# EAGLE design CTD_Prototype_v1.0 (EAGLE 8.4.1)
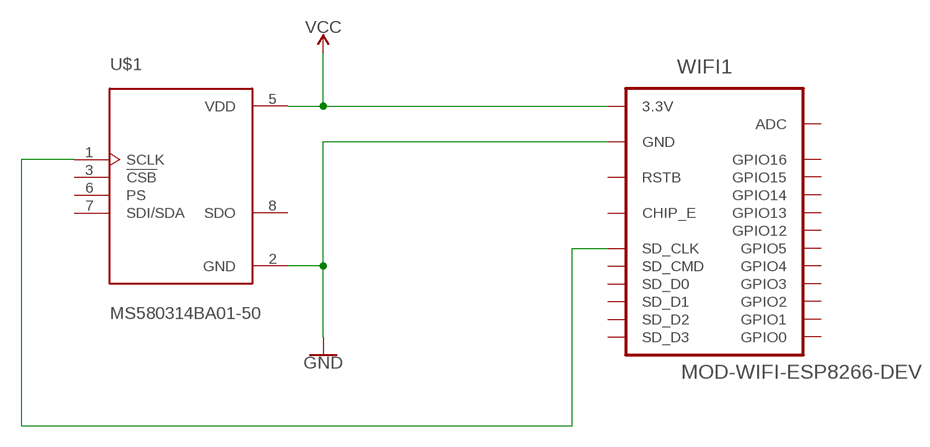
[diagram p0: schematic, sheet 1]

## Parts
U$1  MS580314BA01-50  [XDCR_MS580314BA01-50]
WIFI1  MOD-WIFI-ESP8266-DEV  [MOD-WIFI-ESP8266-DEV]

## Nets
GND: U$1.2(GND) WIFI1.GND WIFI1.GND.1(GND)
N$1: U$1.1(SCLK) WIFI1.SD_CLK WIFI1.SD_CLK.1(SD_CLK)
VCC: U$1.5(VDD) WIFI1.3.3V WIFI1.3.3V.1(3.3V)
Unconnected: U$1.3(!CSB) U$1.6(PS) U$1.7(SDI/SDA) U$1.8(SDO) WIFI1.ADC WIFI1.ADC.1(ADC) WIFI1.CHIP_E WIFI1.CHIP_E.1(CHIP_E) WIFI1.GPIO0 WIFI1.GPIO0.1(GPIO0) WIFI1.GPIO1 WIFI1.GPIO1.1(GPIO1) WIFI1.GPIO2 WIFI1.GPIO2.1(GPIO2) WIFI1.GPIO3 WIFI1.GPIO3.1(GPIO3) WIFI1.GPIO4 WIFI1.GPIO4.1(GPIO4) WIFI1.GPIO5 WIFI1.GPIO5.1(GPIO5) WIFI1.GPIO12 WIFI1.GPIO12.1(GPIO12) WIFI1.GPIO13 WIFI1.GPIO13.1(GPIO13) WIFI1.GPIO14 WIFI1.GPIO14.1(GPIO14) WIFI1.GPIO15 WIFI1.GPIO15.1(GPIO15) WIFI1.GPIO16 WIFI1.GPIO16.1(GPIO16) WIFI1.RSTB WIFI1.RSTB.1(RSTB) WIFI1.SD_CMD WIFI1.SD_CMD.1(SD_CMD) WIFI1.SD_D0 WIFI1.SD_D0.1(SD_D0) WIFI1.SD_D1 WIFI1.SD_D1.1(SD_D1) WIFI1.SD_D2 WIFI1.SD_D2.1(SD_D2) WIFI1.SD_D3 WIFI1.SD_D3.1(SD_D3)

## Library data of the parts
U$1 = MS580314BA01-50:MS580314BA01-50: Miniature 14 bar Module; AVAILABILITY: Unavailable; MF: TE Connectivity; MP: MS580314BA01-50; PACKAGE: None; PRICE: None
WIFI1 = Olimex-esp8266-dev:MOD-WIFI-ESP8266-DEV: Olimex MOD-WIFI-ESP8266-DEV rev.A; DIGI-KEY: 1188-1154-ND; MOUSER: 909-WIFI-ESP8266-DEV; TME: MOD-WIFI-ESP8266-DEV

## Board
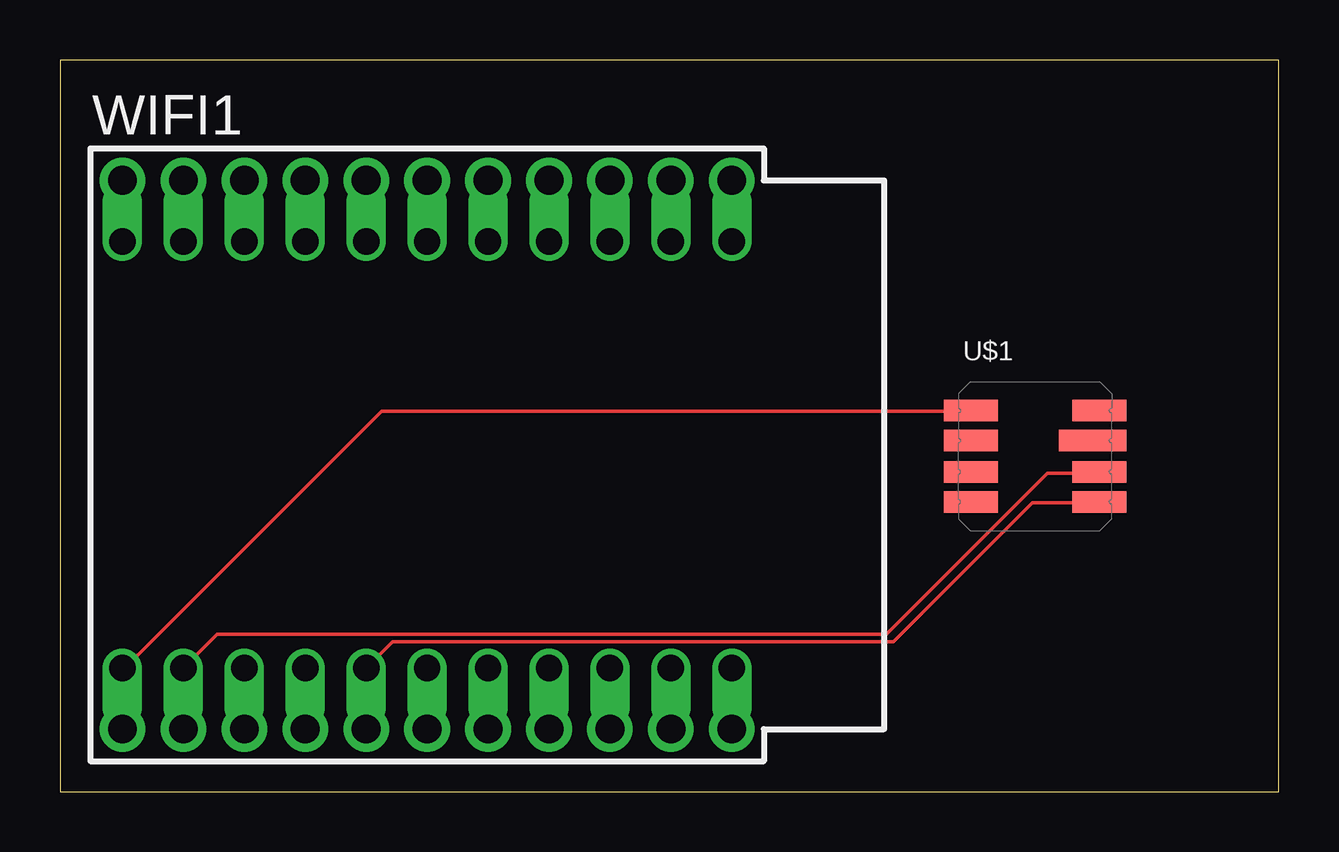
[diagram p1: board, top side]

Size 50.8 x 30.48 mm. Coordinates in mm from the lower left corner, seen from the top.
Outline: 0,0 50.8,0 50.8,30.48 0,30.48 0,0
Copper layers (1*16): Top 0.035mm / dielectric 1.5mm / Bottom 0.035mm
Design rules "default": minimum track width 6mil, minimum drill 0.35mm, track to track 6mil, track to pad 6mil, pad to pad 6mil, via to via 6mil, smd to smd 6mil, copper to edge 40mil, drill to drill 6mil, minimum pad ring 10mil, minimum via ring 8mil, stop-mask expansion 4mil, vias tented up to drill 0mil, thermal gap 10mil

### Footprints (pad centres in the part's own frame; a part is rotated, then mirrored left to right if it is on the bottom)
XDCR_MS580314BA01-50 = smd 2.25 x 0.9: 1 2.675,-1.899; 2 2.675,-0.649; 4 2.675,1.901; 5 -2.675,1.901; 6 -2.675,0.651; 7 -2.675,-0.649; 8 -2.675,-1.899 | smd 2.8 x 0.9: 3 2.4,0.651
MOD-WIFI-ESP8266-DEV = drill 1.1 offset: 3.3V 1.333,3.873; ADC 26.733,21.654; CHIP_E 21.654,21.654; GND 3.873,3.873; GPIO0 3.873,21.654; GPIO1 6.413,3.873; GPIO2 6.413,21.654; GPIO3 8.954,3.873; GPIO4 1.333,21.654; GPIO5 26.733,3.873; GPIO12 16.573,21.654; GPIO13 11.493,21.654; GPIO14 14.034,21.654; GPIO15 8.954,21.654; GPIO16 19.113,21.654; RSTB 24.194,21.654; SD_CLK 11.493,3.873; SD_CMD 19.113,3.873; SD_D0 21.654,3.873; SD_D1 16.573,3.873; SD_D2 14.034,3.873; SD_D3 24.194,3.873 | drill 1.2 pad 1.9: 3.3V.1 1.333,1.333; ADC.1 26.733,24.194; CHIP_E.1 21.654,24.194; GND.1 3.873,1.333; GPIO0.1 3.873,24.194; GPIO1.1 6.413,1.333; GPIO2.1 6.413,24.194; GPIO3.1 8.954,1.333; GPIO4.1 1.333,24.194; GPIO5.1 26.733,1.333; GPIO12.1 16.573,24.194; GPIO13.1 11.493,24.194; GPIO14.1 14.034,24.194; GPIO15.1 8.954,24.194; GPIO16.1 19.113,24.194; RSTB.1 24.194,24.194; SD_CLK.1 11.493,1.333; SD_CMD.1 19.113,1.333; SD_D0.1 21.654,1.333; SD_D1.1 16.573,1.333; SD_D2.1 14.034,1.333; SD_D3.1 24.194,1.333

### Placement (x,y rotation side)
U$1  40.64,13.97 0 top
WIFI1  1.27,1.27 0 top

### Tracks (layer width: path | path; a pad name or v marks a point on that pad's centre or on a via)
GND
  Top 0.152: WIFI1.GND.1 5.18,2.74 5.18,5.03 WIFI1.GND 6.55,6.55 34.44,6.55 41.15,13.26 43.28,13.26 U$1.2
N$1
  Top 0.152: WIFI1.SD_CLK.1 12.8,2.74 12.8,5.03 WIFI1.SD_CLK 13.87,6.25 34.75,6.25 40.54,12.04 43.28,12.04 U$1.1
VCC
  Top 0.152: WIFI1.3.3V.1 2.59,2.74 2.59,5.03 WIFI1.3.3V 2.74,5.18 13.41,15.85 37.95,15.85 U$1.5